# EAGLE schematic WiazkaStacyjka (EAGLE 7.7.0)
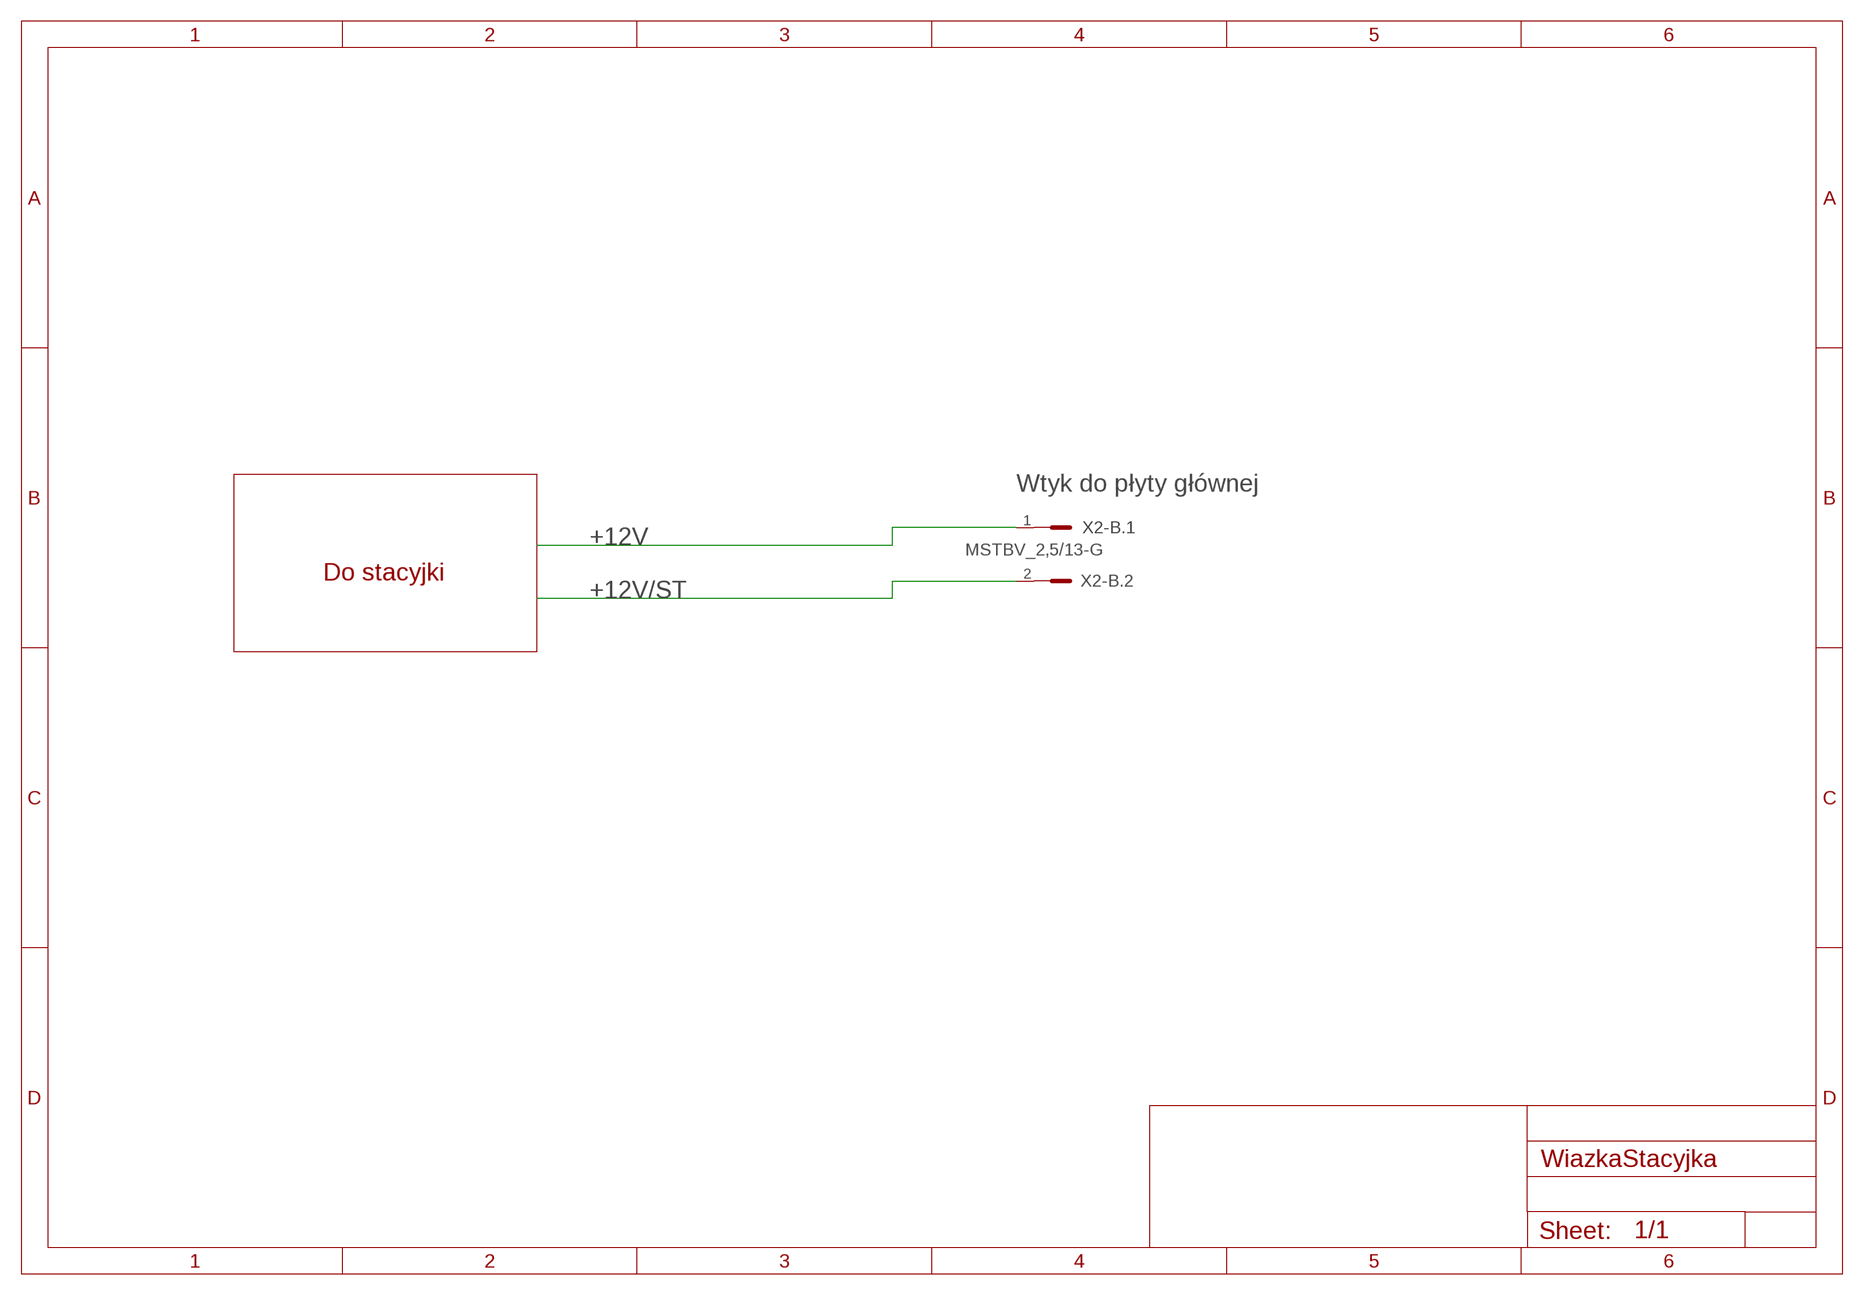
[diagram p0: schematic, sheet 1]

## Parts
X2-B  MSTBV_2,5/13-G  [MSTBV_2,5/13-G]

## Nets
+12V: X2-B.1
+12V/ST: X2-B.2
Unconnected: X2-B.3 X2-B.4 X2-B.5 X2-B.6 X2-B.7 X2-B.8 X2-B.9 X2-B.10 X2-B.11 X2-B.12 X2-B.13

## Notes on the sheet
- Wtyk do płyty głównej
- Do stacyjki

## Library data of the parts
X2-B = con-phoenix-500:MSTBV_2,5/13-G: Grundleiste - MSTBV 2,5/13-G - 1753657 Grundgehäuse, Nennstrom: 12 A Bemessungsspannung (III/2): 320 V Polzahl: 13 Rastermaß: 5 mm Farbe: grün Kontaktoberfläche: Zinn Montage: Löten